# Altium schematic sheet Top.SchDoc
size A4; SheetNumber: 1; SheetTotal: 5
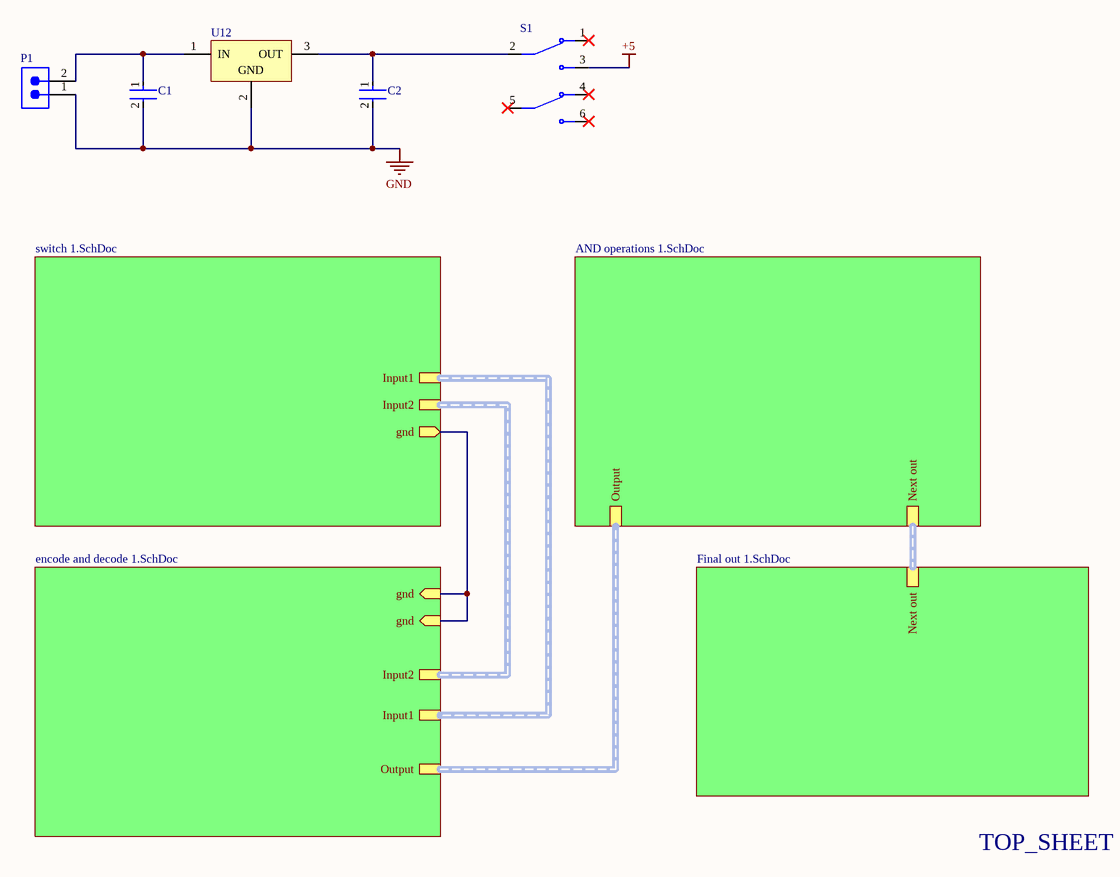
[diagram p0: Top.SchDoc]

## Parts
C1  D222K33Y5PL6UJ5R  [FP-D222K33Y5PL6UJ5R-MFG]  (value not drawn)
C2  D222K33Y5PL6UJ5R  [FP-D222K33Y5PL6UJ5R-MFG]  (value not drawn)
P1  691311500002  [691311500002]  (value not drawn)
S1  TL2230OAF140  [SW_TL2230OAF140]  (value not drawn)
U12  L7805CP  [TO220FP]  (value not drawn)

## Sub-sheets
Designator = switch 1.SchDoc: Input1 (harness Input1), Input2 (harness Input2), gnd (out)
Designator = encode and decode 1.SchDoc: Input1 (harness Input1), Input2 (harness Input2), Output (harness Output), gnd (in), gnd (in)
Designator = AND operations 1.SchDoc: Output (harness Output), Next out (harness Next out)
Designator = Final out 1.SchDoc: Next out (harness Next out)

## Nets
+5: S1.3(NO1)
GND: C1.2 C2.2 P1.1 U12.2(GND)
NetC1_1: C1.1 P1.2 U12.1(IN)
NetC2_1: C2.1 S1.2(COM1) U12.3(OUT)
(unnamed): sheet Designator/gnd, sheet Designator/gnd, sheet Designator/gnd

Not connected (* = marked no-connect by the designer): S1 1(NC1)* 4(NC2)* 5(COM2)* 6(NO2)*

## Notes on the sheet
- TOP_SHEET

## Library data of the parts
C1 C2 = CMP-02417-000074-1: CAP CER 2200PF 500V Y5P RADIAL; Tolerance: 10%; Lead/Base Style: Kinked; Capacitance: 2.2nF; Lead Diameter: 0.6mm; Value: 2.2nF; Package Quantity: 2000; RoHS Compliant: Yes; Termination: Radial; Mount: Through Hole; Lead Pitch: 5mm; Case/Package: Radial; Series: D; Depth: 4mm; Dielectric: Y5P; Radiation Hardening: No; Resistor Type: Ceramic; Voltage Rating: 500V; Contact Plating: Tin; Packaging: Tape and Reel; Min Operating Temperature: -30°C; Max Operating Temperature: 85°C; Construction: RADIAL
P1 = CMP-1502-02123-2: NexarPartId: 8917741; Current: 20A; Number of Contacts: 2; Number of Levels: 1; Gender: Male; Pitch: 5.08mm; Voltage: 300V; Length: 8.5mm; Number of Pins: 2; Termination: Solder; Color: Green; Number of Rows: 1; Contact Plating: Tin; Number of Positions Per Level: 2; Orientation: Vertical; REACH SVHC: Unknown; Packaging: Box; Height: 12mm; Contact Material: Brass; Mount: Through Hole; Width: 10.16mm; RoHS: Compliant; Lead Pitch: 5.08mm
S1 = TL2230OAF140: Pushbutton Switch DPDT Standard Through Hole; MF: E-Switch; SnapEDA_Link: https://www.snapeda.com/parts/TL2230OAF140/E-Switch/view-part/?ref=snap; Package: None; Value: *; MP: TL2230OAF140; Check_prices: https://www.snapeda.com/parts/TL2230OAF140/E-Switch/view-part/?ref=eda
U12 = CMP-0244-00474-1: Positive Voltage Regulator, 5V, 3-Pin TO-220FP; ComponentLink1Description: Manufacturer URL; ComponentLink2Description: Datasheet; DatasheetVersion: 16/11/2011; PackageDescription: TO, Thru-Hole, Vertical, Heatsink Mounted; 3 In-Line Leads; Pitch 2.54 mm; ComponentLink2URL: http://www.st.com/internet/com/TECHNICAL_RESOURCES/TECHNICAL_LITERATURE/DATASHEET/CD00000444.pdf; ComponentLink1URL: http://www.st.com; PackageVersion: 2011; PackageReference: TO220FP